# EAGLE design xbee_Featherwing (EAGLE 9.4.1)
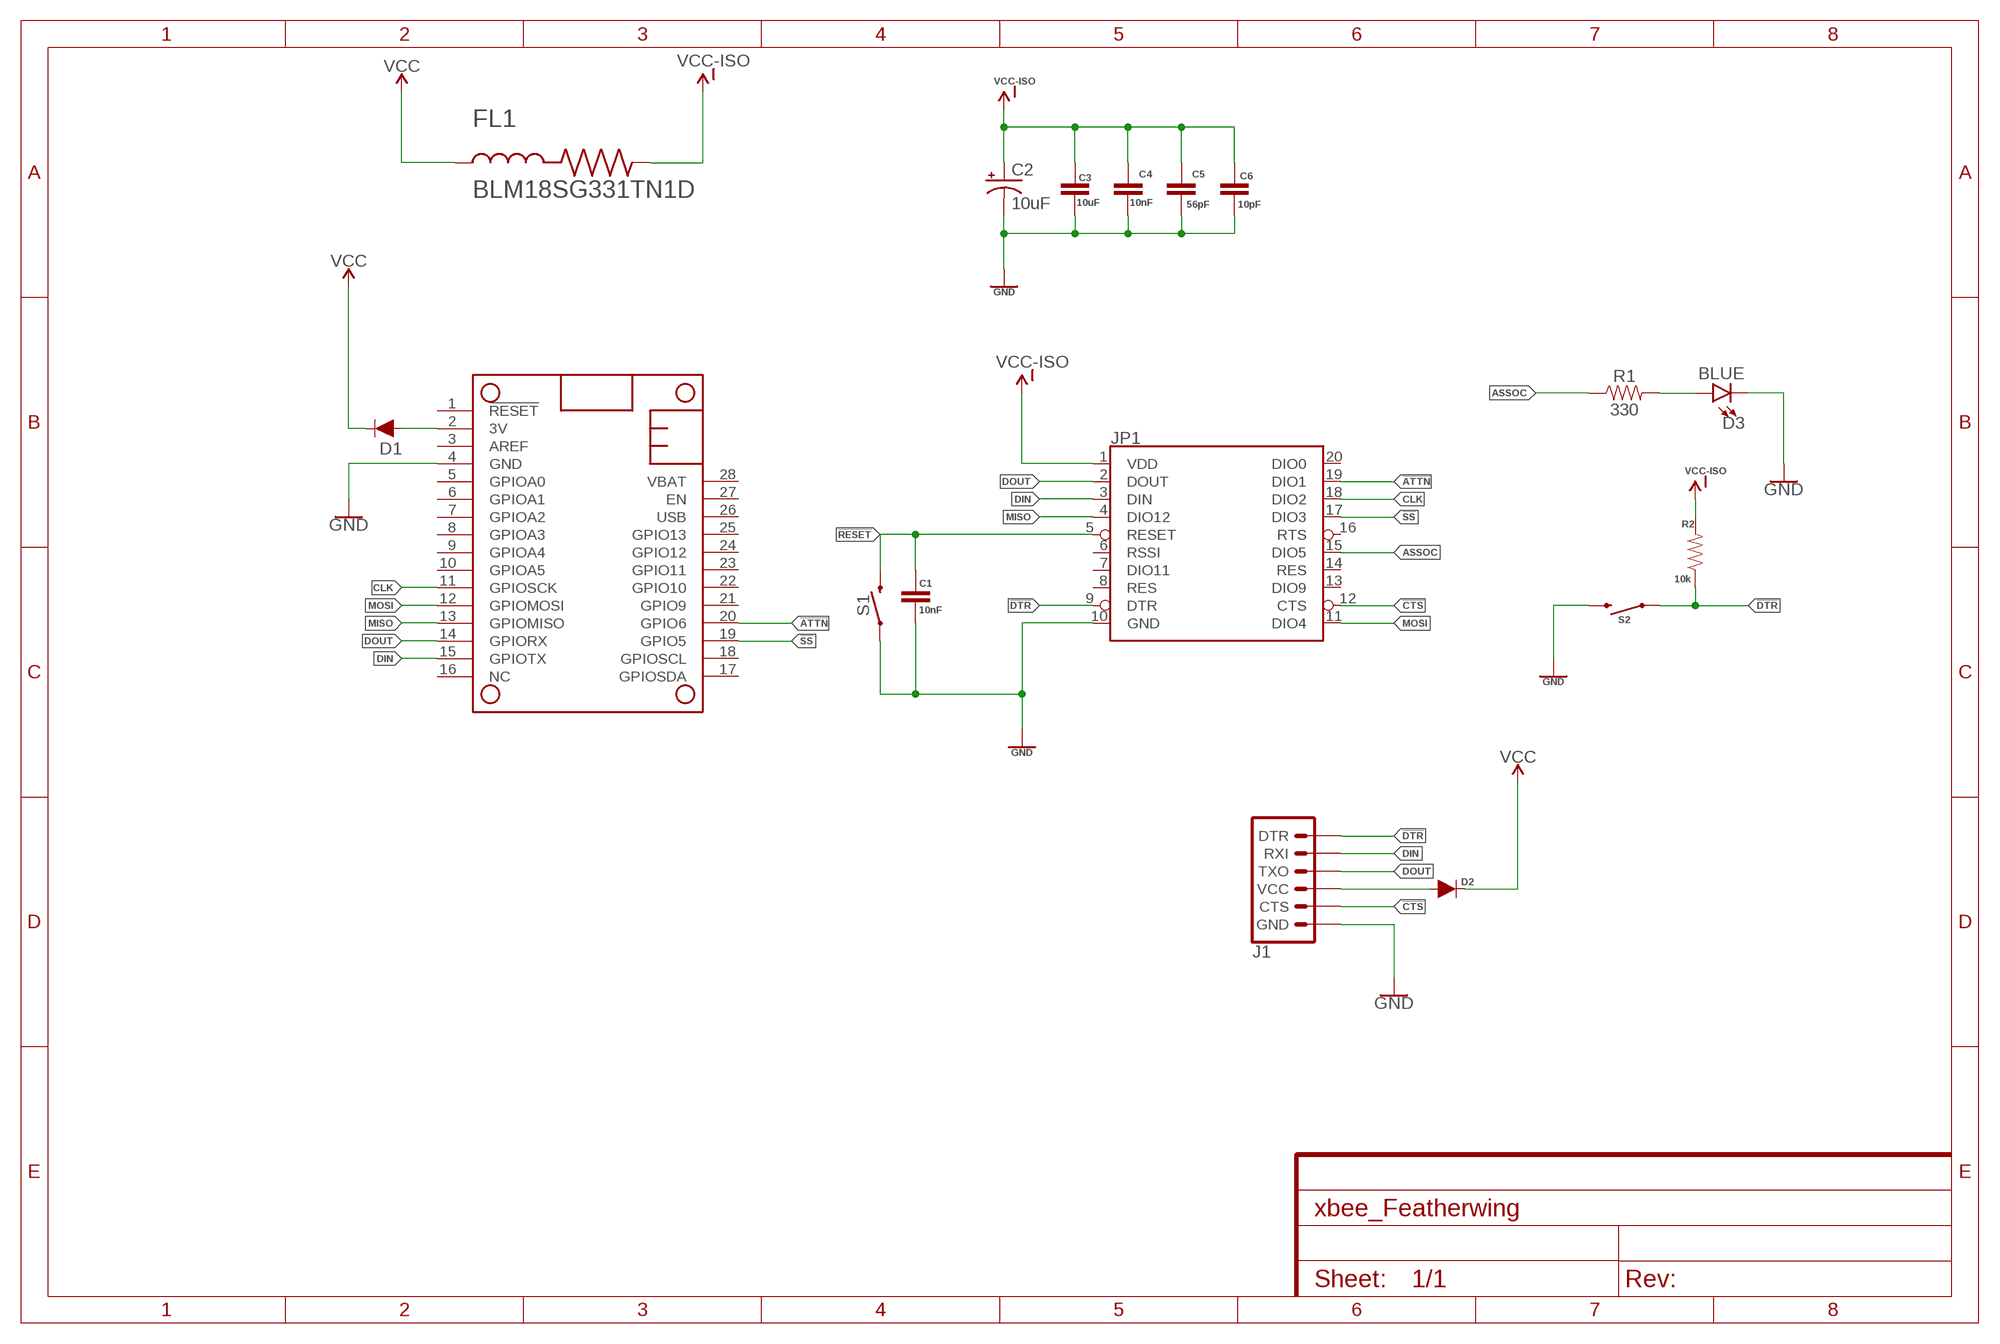
[diagram p0: schematic, sheet 1]

## Parts
C1  10nF  10NF-0603-50V-10%  [0603]
C2  10uF  10UF-POLAR-EIA3216-16V-10%(TANT)  [EIA3216]
C3  10uF  10UF-0603-6.3V-20%  [0603]
C4  10nF  10NF-0603-50V-10%  [0603]
C5  56pF  560PF-0603-50V-5%  [0603]
C6  10pF  10PF-0603-50V-5%  [0603]
D1  250mA/100V  DIODE-BAS16J  [SOD-323]
D2  250mA/100V  DIODE-BAS16J  [SOD-323]
D3  BLUE  LED-BLUE0603  [LED-0603]
FL1  BLM18SG331TN1D  [BEADC1608X65N]
J1  6_PIN_SERIAL_TARGETSILK  [6_PIN_SERIAL_TARGET_SIDE_W_SILK]
JP1  XBEESMD  [XBEE-SMD]
MS1  FEATHERWINGXBEE  [FEATHERWING_XBEE]
R1  330  330OHM-0603-1/10W-1%  [0603]
R2  10k  10KOHM-0603-1/10W-1%  [0603]
S1  MOMENTARY-SWITCH-SPST-PTH-6.0MM  [TACTILE_SWITCH_PTH_6.0MM]
S2  MOMENTARY-SWITCH-SPST-PTH-6.0MM  [TACTILE_SWITCH_PTH_6.0MM]

## Nets
3V: D1.A MS1.2(3V)
!ATTN: JP1.19(DIO1) MS1.20(GPIO6)
!CTS: J1.P$5(CTS) JP1.12(CTS)
!DTR: J1.P$1(DTR) JP1.9(DTR) R2.1 S2.1
!RESET: C1.1 JP1.5(RESET) S1.3
!SS: JP1.17(DIO3) MS1.19(GPIO5)
ASSOC: JP1.15(DIO5) R1.1
CLK: JP1.18(DIO2) MS1.11(GPIOSCK)
DIN: J1.P$3(RXI) JP1.3(DIN) MS1.15(GPIOTX)
DOUT: J1.P$2(TXO) JP1.2(DOUT) MS1.14(GPIORX)
GND: C1.2 C2.- C3.2 C4.2 C5.2 C6.2 D3.C J1.P$6(GND) JP1.10(GND) MS1.4(GND) S1.1 S2.3
MISO: JP1.4(DIO12) MS1.13(GPIOMISO)
MOSI: JP1.11(DIO4) MS1.12(GPIOMOSI)
N$2: D2.A J1.P$4(VCC)
N$3: D3.A R1.2
VCC: D1.C D2.C FL1.1
VCC-ISO: C2.+ C3.1 C4.1 C5.1 C6.1 FL1.2 JP1.1(VDD) R2.2
Unconnected: JP1.6(RSSI) JP1.7(DIO11) JP1.8(RES) JP1.13(DIO9) JP1.14(RES) JP1.16(RTS) JP1.20(DIO0) MS1.1(!RESET) MS1.3(AREF) MS1.5(GPIOA0) MS1.6(GPIOA1) MS1.7(GPIOA2) MS1.8(GPIOA3) MS1.9(GPIOA4) MS1.10(GPIOA5) MS1.16(NC) MS1.17(GPIOSDA) MS1.18(GPIOSCL) MS1.21(GPIO9) MS1.22(GPIO10) MS1.23(GPIO11) MS1.24(GPIO12) MS1.25(GPIO13) MS1.26(USB) MS1.27(EN) MS1.28(VBAT)

## Library data of the parts
C1 C4 = SparkFun-Capacitors:10NF: 0.01uF/10nF/10,000pF ceramic capacitors A capacitor is a passive two-terminal electrical component used to store electrical energy temporarily in an electric field. CAP-09321; PROD_ID: CAP-00867
C2 = SparkFun-Capacitors:10UF-POLAR: 10.0µF polarized capacitors A capacitor is a passive two-terminal electrical component used to store electrical energy temporarily in an electric field.; PROD_ID: CAP-00811
C3 = SparkFun-Capacitors:10UF: 10.0µF ceramic capacitors A capacitor is a passive two-terminal electrical component used to store electrical energy temporarily in an electric field.; PROD_ID: CAP-11015
C5 = SparkFun-Capacitors:560PF: 0.56nF/560pF ceramic capacitors A capacitor is a passive two-terminal electrical component used to store electrical energy temporarily in an electric field.; PROD_ID: CAP-08749; VALUE: 560pF
C6 = SparkFun-Capacitors:10PF: 10pF ceramic capacitors A capacitor is a passive two-terminal electrical component used to store electrical energy temporarily in an electric field.; PROD_ID: CAP-11812
D1 D2 = SparkFun-DiscreteSemi:DIODE: Diode These are standard reverse protection diodes and small signal diodes. SparkFun Products: SparkFun SparkPunk Sound Kit <https://www.sparkfun.com/products/11177> SparkFun ESP8266 Thing <https://www.sparkfun.com/products/13231>; PROD_ID: DIO-09646
D3 = SparkFun-LED:LED-BLUE: Blue SMD LED Used in manufacturing of various products at SparkFun Packages: 0603 - SMD 0603 package [Product Link] <http://www.digikey.com/product-detail/en/SMLE12BC7TT86/511-1589-2-ND/1641808> 1206 - SMD1206 package [Product Link] <http://www.digikey.com/product-detail/en/lite-on-inc/LTST-C150TBKT/160-1643-1-ND/573584> SparkFun Products: ESP8266 Thing-Dev Board <https://www.sparkfun.com/products/13711> RedBoard <https://www.sparkfun.com/products/12757>; PROD_ID: DIO-08575
FL1 = BLM18SG331TN1D:BLM18SG331TN1D: IC REG BOOST ADJ 85MA TSOT23-8; AVAILABILITY: Unavailable; DESCRIPTION: 330 Ohms @ 100MHz 1 Power Line Ferrite Bead 0603 _1608 Metric_ 1.5A 70mOhm; MF: Murata Electronics; MP: BLM18SG331TN1D; PACKAGE: 1608 Murata; PRICE: None
J1 = SparkFun-Connectors:6_PIN_SERIAL_TARGET: 6-pin header connection for use with the "FTDI BASIC" pinout - TARGET SIDE. Also known as "Arduino Serial Program Header". It is used to mate with our FTDI Basic serial programmers using the Arduino IDE. Note, this device has "TARGET" in the name. It is intended to be used on a design that contains a target micro-controller that you wish to program. The "sister" device, named "CABLE" is inteneded to be used on a design that usually lives on the end of your USB cable and prvides the converter chip (FTDI232 or FTDI231x) to commnicate serial RX/TX. You can populate with some of these: Break Away Headers - Straight <https://www.sparkfun.com/products/116> (PRT-00116) For reference (or to suit your programming needs) check out these designs: SparkFun FTDI Basic Breakout - 5V <https://www.sparkfun.com/products/9716> (DEV-09716) SparkFun FTDI Basic Breakout - 3.3V <https://www.sparkfun.com/products/9873> (DEV-09873) SparkFun FTDI SmartBasic <https://www.sparkfun.com/products/12935> (DEV-12935) SparkFun Beefy 3 - FTDI Basic Breakout <https://www.sparkfun.com/products/13746> (DEV-13746)
JP1 = SparkFun-RF:XBEE: Digi XBee and XBee Pro XBees are tiny blue chips that can communicate wirelessly with each other. They can do simple things, like replacing a couple of wires in serial communication, which is nice when you want to make a remote for your paintball vehicle. SparkFun Products SparkFun XBee Buying Guide <https://www.sparkfun.com/pages/xbee_guide> SparkFun XBee Explorer USB <https://www.sparkfun.com/products/11812> (WRL-11812) Breakout Board for XBee Module <https://www.sparkfun.com/products/8276> (WRL-8276) SparkFun XBee Explorer Regulated <https://www.sparkfun.com/products/11373> (WRL-11373) SparkFun XBee Explorer Dongle <https://www.sparkfun.com/products/11697> (WRL-11697) SparkFun XBee Shield <https://www.sparkfun.com/products/12847> (WRL-12847) SparkFun XBee Explorer Serial <https://www.sparkfun.com/products/13225> (WRL-13225); PROD_ID: CONN-09042
MS1 = adafruit:FEATHERWING
R1 = SparkFun-Resistors:330OHM: 330Ω resistor A resistor is a passive two-terminal electrical component that implements electrical resistance as a circuit element. Resistors act to reduce current flow, and, at the same time, act to lower voltage levels within circuits. - Wikipedia; PROD_ID: RES-00818
R2 = SparkFun-Resistors:10KOHM: 10kΩ resistor A resistor is a passive two-terminal electrical component that implements electrical resistance as a circuit element. Resistors act to reduce current flow, and, at the same time, act to lower voltage levels within circuits. - Wikipedia; PROD_ID: RES-00824
S1 S2 = SparkFun-Switches:MOMENTARY-SWITCH-SPST: Momentary Switch (Pushbutton) - SPST Normally-open (NO) SPST momentary switches (buttons, pushbuttons). Variants PTH-12MM - 12mm square, through-hole Momentary Pushbutton Switch - 12mm Square <https://www.sparkfun.com/products/9190> (COM-09190) PTH-6.0MM, PTH-6.0MM-KIT - 6.0mm square, through-hole Mini Pushbutton Switch <https://www.sparkfun.com/products/97> (COM-00097) KIT package intended for soldering kit's - only one side of pads' copper is exposed. PTH-RIGHT-ANGLE-KIT - Right-angle, through-hole Right Angle Tactile Button <https://www.sparkfun.com/products/10791> - Used on SparkFun BigTime Watch Kit <https://www.sparkfun.com/products/11734> SMD-12MM - 12mm square, surface-mount Tactile Button - SMD (12mm) <https://www.sparkfun.com/products/12993> (COM-12993) Used on SparkFun PicoBoard <https://www.sparkfun.com/products/11888> SMD-4.5MM - 4.5mm Square Trackball Switch Used on SparkFun Blackberry Trackballer Breakout <https://www.sparkfun.com/products/13169> SMD-4.6MMX2.8MM - 4.60mm x 2.80mm, surface mount Used on SparkFun SAMD21 Mini Breakout <https://www.sparkfun.com/products/13664> SMD-5.2MM, SMD-5.2-REDUNDANT - 5.2mm square, surface-mount Mini Pushbutton Switch - SMD <https://www.sparkfun.com/products/8720> (COM-08720) Used on Arduino Pro Mini <https://www.sparkfun.com/products/11114> REDUNDANT package connects both switch circuits together SMD-6.0X3.5MM - 6.0 x 3.5mm, surface mount Momentary Reset Switch SMD <https://www.sparkfun.com/products/8229> (COM-08229) SMD-6.2MM-TALL - 6.2mm square, surface mount Tactile Button - SMD (6mm) <https://www.sparkfun.com/products/12992> Used on SparkFun Digital Sandbox <https://www.sparkfun.com/products/12651> SMD-RIGHT-ANGLE - Right-angle, surface mount Used on SparkFun Block for Intel® Edison - Arduino <https://www.sparkfun.com/products/13036>; PROD_ID: SWCH-08441; SF_SKU: COM-00097

## Board
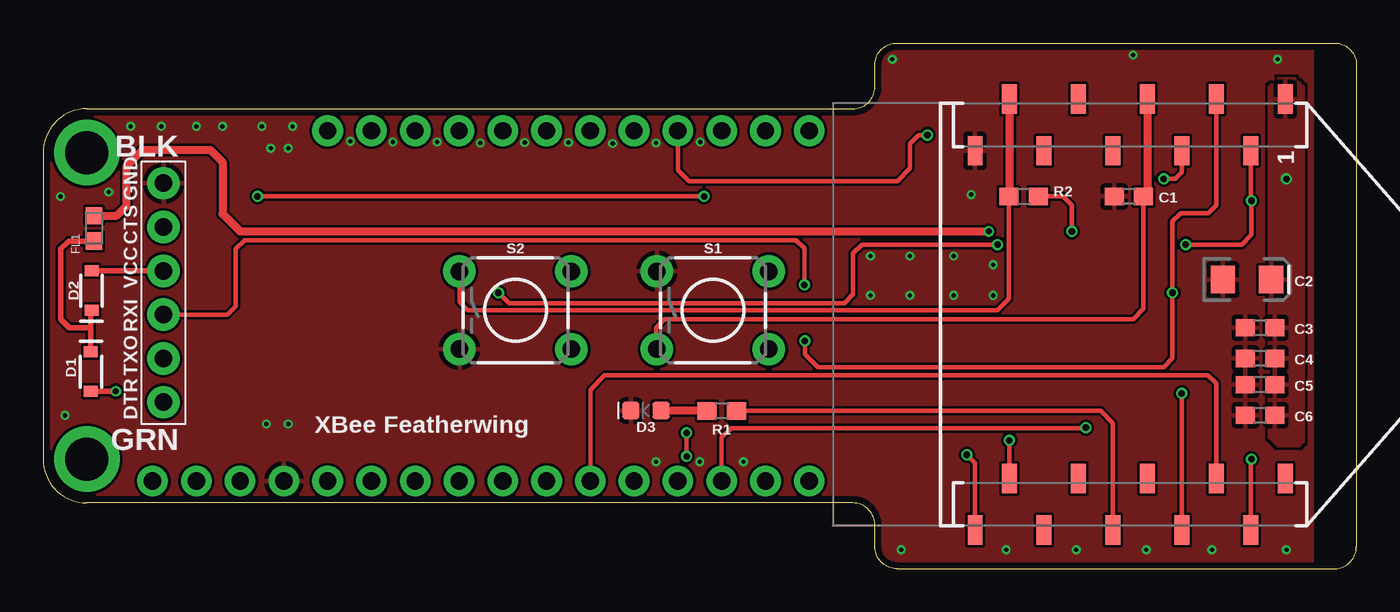
[diagram p1: board, top side]
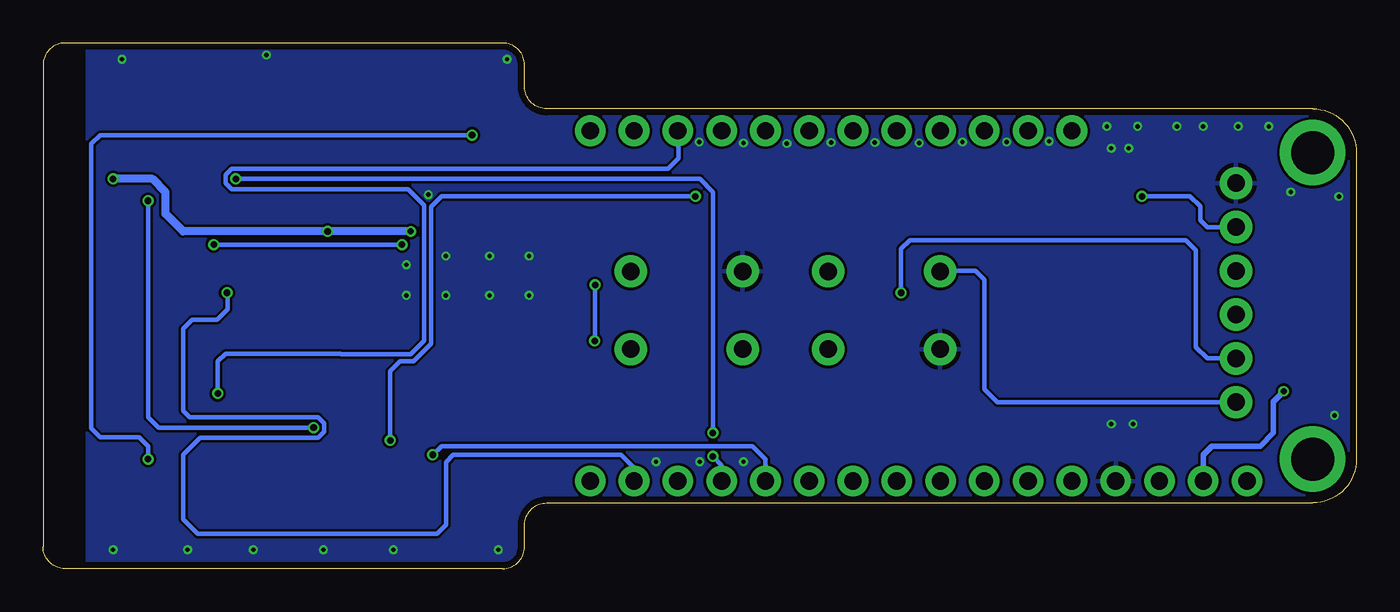
[diagram p2: board, bottom side, seen from below]

Size 76.2 x 30.48 mm. Coordinates in mm from the lower left corner, seen from the top.
Copper layers (1*16): Top 0.035559375mm / dielectric 1.6mm / Bottom 0.035559375mm
Design rules "oshpark-2layer": minimum track width 6mil, minimum drill 10mil, track to track 6mil, track to pad 6mil, pad to pad 6mil, via to via 6mil, smd to smd 6mil, copper to edge 15mil, drill to drill 6mil, minimum pad ring 5mil, minimum via ring 5mil, stop-mask expansion 2.5mil, vias tented up to drill 0mil, thermal gap 10mil

### Footprints (pad centres in the part's own frame; a part is rotated, then mirrored left to right if it is on the bottom)
0603 = smd 1.1 x 1: 1 -0.85,0; 2 0.85,0
EIA3216 = smd 1.4 x 1.6: + 1.4,0; - -1.4,0
SOD-323 = smd 0.63 x 0.83: A 1.15,0; C -1.15,0
LED-0603 = smd 1 x 1: A -0.877,0; C 0.877,0
BEADC1608X65N = smd 1 x 0.97: 1 -0.735,0; 2 0.735,0
6_PIN_SERIAL_TARGET_SIDE_W_SILK = drill 1.016 pad 1.88: P$1 -6.35,0; P$2 -3.81,0; P$3 -1.27,0; P$4 1.27,0; P$5 3.81,0; P$6 6.35,0
XBEE-SMD = smd 1.7 x 0.85: 1 -12.5,20; 2 -9.5,18; 3 -12.5,16; 4 -9.5,14; 5 -12.5,12; 6 -9.5,10; 7 -12.5,8; 8 -9.5,6; 9 -12.5,4; 10 -9.5,2; 11 12.5,2; 12 9.5,4; 13 12.5,6; 14 9.5,8; 15 12.5,10; 16 9.5,12; 17 12.5,14; 18 9.5,16; 19 12.5,18; 20 9.5,20
FEATHERWING_XBEE = drill 1 pad 1.778: 1 6.35,1.27; 2 8.89,1.27; 3 11.43,1.27; 4 13.97,1.27; 5 16.51,1.27; 6 19.05,1.27; 7 21.59,1.27; 8 24.13,1.27; 9 26.67,1.27; 10 29.21,1.27; 11 31.75,1.27; 12 34.29,1.27; 13 36.83,1.27; 14 39.37,1.27; 15 41.91,1.27; 16 44.45,1.27; 17 44.45,21.59; 18 41.91,21.59; 19 39.37,21.59; 20 36.83,21.59; 21 34.29,21.59; 22 31.75,21.59; 23 29.21,21.59; 24 26.67,21.59; 25 24.13,21.59; 26 21.59,21.59; 27 19.05,21.59; 28 16.51,21.59 | drill 2.5 pad 3.81: P$1 2.54,20.32; P$2 2.54,2.54
TACTILE_SWITCH_PTH_6.0MM = drill 1.016 pad 1.88: 1 -3.251,2.261; 2 3.251,2.261; 3 -3.251,-2.261; 4 3.251,-2.261

### Placement (x,y rotation side)
C1  62.99,21.59 180 top
C2  69.85,16.76 0 top
C3  70.61,13.97 180 top
C4  70.61,12.19 180 top
C5  70.61,10.67 180 top
C6  70.61,8.89 180 top
D1  2.77,11.43 270 top
D2  2.82,16.13 90 top
D3  34.98,9.17 180 top
FL1  2.95,19.74 90 top
J1  6.99,16 90 top
JP1  52.07,14.73 270 top
MS1  0,3.81 0 top
R1  39.37,9.14 180 top
R2  56.9,21.59 0 top
S1  38.86,14.99 0 top
S2  27.41,14.99 0 top

### Tracks (layer width: path | path; a pad name or v marks a point on that pad's centre or on a via)
3V  (via drill 0.35)
  Top 0.305: v4.22,10.29 4.21,10.28 D1.A
  Bottom 0.305: MS1.2 8.89,6.6 8.38,7.11 5.59,7.11 4.83,7.87 4.83,9.68 v4.22,10.29
!ATTN  (via drill 0.38)
  Top 0.254: JP1.19 70.07,6.32 v70.1,6.35 | v51.31,25.15 50.8,25.15 50.29,24.64 50.29,23.22 49.55,22.48 37.47,22.48 36.83,23.11 MS1.20
  Bottom 0.254: v70.1,6.35 70.1,7.11 70.61,7.62 72.9,7.62 73.41,8.13 73.41,24.64 72.9,25.15 v51.31,25.15
!CTS  (via drill 0.38)
  Top 0.254: JP1.12 v56.07,7.43 v56.06,7.44 | v38.35,21.59 v12.45,21.59
  Bottom 0.254: v56.06,7.44 56.06,11.46 55.47,12.04 54.7,12.04 53.7,13.04 53.7,20.98 53.09,21.59 v38.35,21.59 | v12.45,21.59 9.65,21.59 9.07,21.01 9.07,20.22 8.66,19.81 J1.P$5
!DTR
  Top 0.254: R2.1 56.05,15.66 55.37,14.99 24.64,14.99 24.16,15.47 S2.1
  Top 0.457: JP1.9 56.07,21.61 R2.1
  Bottom 0.254: J1.P$1 20.83,9.65 21.59,10.41 21.59,16.76 22.1,17.27 24.13,17.27 S2.1
!RESET
  Top 0.254: C1.1 63.84,15.07 63.25,14.48 36.07,14.48 35.56,13.97 35.56,12.78 S1.3
  Top 0.457: JP1.5 64.07,21.82 C1.1
!SS  (via drill 0.38)
  Top 0.254: JP1.17 v66.07,10.15 v66.06,10.16
  Bottom 0.254: v66.06,10.16 66.06,12.01 65.61,12.47 58.93,12.47 58.9,12.45 54.86,12.45 54.1,13.21 54.1,21.08 55.03,22.01 56.49,22.01 56.64,22.01 65.27,22.01 65.62,22.36 65.62,22.85 65.27,23.2 39.94,23.2 39.34,23.8 39.34,25.38 MS1.19
ASSOC
  Top 0.254: JP1.15 62.07,8.44 61.37,9.14 R1.1
CLK
  Top 0.254: JP1.18 68.07,9.65 68.07,10.75 67.59,11.23 32.59,11.23 31.75,10.39 MS1.11
DIN  (via drill 0.38)
  Top 0.254: JP1.3 68.07,21.08 67.61,20.62 66.02,20.62 65.53,20.14 v65.53,16 65.53,12.19 65.02,11.68 44.96,11.68 44.2,12.45 v44.2,13.21 | v44.17,16.46 44.17,18.57 43.69,19.05 11.68,19.05 11.18,18.54 11.18,15.21 10.69,14.73 J1.P$3
  Bottom 0.254: MS1.15 41.91,5.84 42.67,6.6 52.4,6.6 52.83,6.17 52.83,2.54 53.34,2.03 67.23,2.03 68.07,2.87 68.07,6.6 67.09,7.58 60.26,7.58 59.91,7.93 59.91,8.43 60.26,8.78 67.7,8.78 68.07,9.14 68.07,13.92 67.56,14.43 66.09,14.43 65.48,15.04 65.48,15.95 v65.53,16 | v44.17,16.46 44.17,13.23 v44.2,13.21
DOUT  (via drill 0.38)
  Top 0.254: MS1.14 39.37,7.62 39.9,8.15 60.48,8.15 v60.5,8.18 | JP1.2 70.07,21.37 v70.1,21.34 70.1,19.36 69.55,18.8 v66.29,18.8 | v55.37,18.8 47.5,18.8 46.99,18.29 46.99,15.9 46.48,15.39 27.03,15.39 v26.42,16
  Bottom 0.254: v60.5,8.18 69.49,8.18 70.1,8.79 v70.1,21.34 | v66.29,18.8 v55.37,18.8 | v26.42,16 26.42,18.54 25.91,19.05 9.91,19.05 9.32,18.47 9.32,12.85 8.66,12.19 J1.P$2
GND  (via drill 0.25)
  other vias: 13.21,24.38 14.22,24.38 12.7,25.65 14.48,25.65 17.83,24.79 20.29,24.74 22.86,24.74 25.37,24.69 30.48,24.71 27.94,24.71 33.05,24.66 35.56,24.69 38.13,24.74 5.08,25.65 6.86,25.65 8.89,25.65 10.41,25.65 14.22,8.38 12.95,8.38 1.27,8.89 3.81,21.84 1.02,21.59 49.28,29.54 63.25,29.79 71.63,29.54 49.78,1.09 55.88,1.09 59.94,1.09 64.01,1.09 67.82,1.09 72.14,1.09 48.01,18.14 50.29,18.14 52.83,18.14 48.01,15.85 50.29,15.85 52.83,15.85 55.12,17.63 55.12,15.85 35.56,6.2 38.1,6.2 40.64,6.2 53.85,21.69
  pour Top (rank 6): 0,0 73.66,0 73.66,30.48 0,30.48
  pour Bottom (rank 6): 0,0 0,30.48 73.66,30.48 73.66,0
MISO  (via drill 0.38)
  Top 0.254: v37.34,6.52 v37.34,7.87 | v65.02,22.61 65.68,22.61 66.07,22.99 JP1.4
  Bottom 0.254: MS1.13 36.83,6.01 v37.34,6.52 | v37.34,7.87 37.34,21.84 38.1,22.61 v65.02,22.61
MOSI  (via drill 0.38)
  Top 0.254: JP1.11 54.07,6.13 v53.59,6.6
  Bottom 0.254: v53.59,6.6 53.09,7.11 35.05,7.11 34.29,6.35 MS1.12
N$2
  Top 0.305: D2.A 6.98,17.28 J1.P$4
N$3
  Top 0.457: R1.2 35.88,9.14 D3.A
VCC
  Top 0.305: D2.C 2.77,14.93 2.77,13.97 | 2.77,13.97 D1.C | 2.77,13.97 1.52,13.97 1.02,14.48 1.02,18.54 1.48,19 FL1.1
VCC-ISO  (via drill 0.35, 0.38)
  Top 0.254: R2.2 59.18,21.59 59.69,21.08 v59.69,19.56
  Top 0.457: FL1.2 4.27,20.47 4.85,21.06 4.85,23.34 5.79,24.28 9.7,24.28 10.41,23.57 10.41,20.57 11.43,19.56 v54.86,19.56
  Bottom 0.457: v54.86,19.56 v59.69,19.56 68.07,19.56 69.09,20.57 69.09,21.84 69.85,22.61 v72.14,22.61
  pour Top: 71.12,8.64 71.12,27.94 71.63,28.45 72.64,28.45 73.15,27.94 73.15,7.37 72.9,7.11 71.88,7.11 71.63,7.11 71.12,7.62

### Text on the board
tNames: XBee Featherwing